# Altium schematic sheet 01 - Notes.SchDoc: 25kW WolfPACK FM3 Six-Pack Inverter
size 431 x 279 mm; Date: 09/2024; DocumentNumber: CRD25DA12N-FMC; Revision: 2.0; SheetNumber: 1; SheetTotal: 9; SheetSize: B
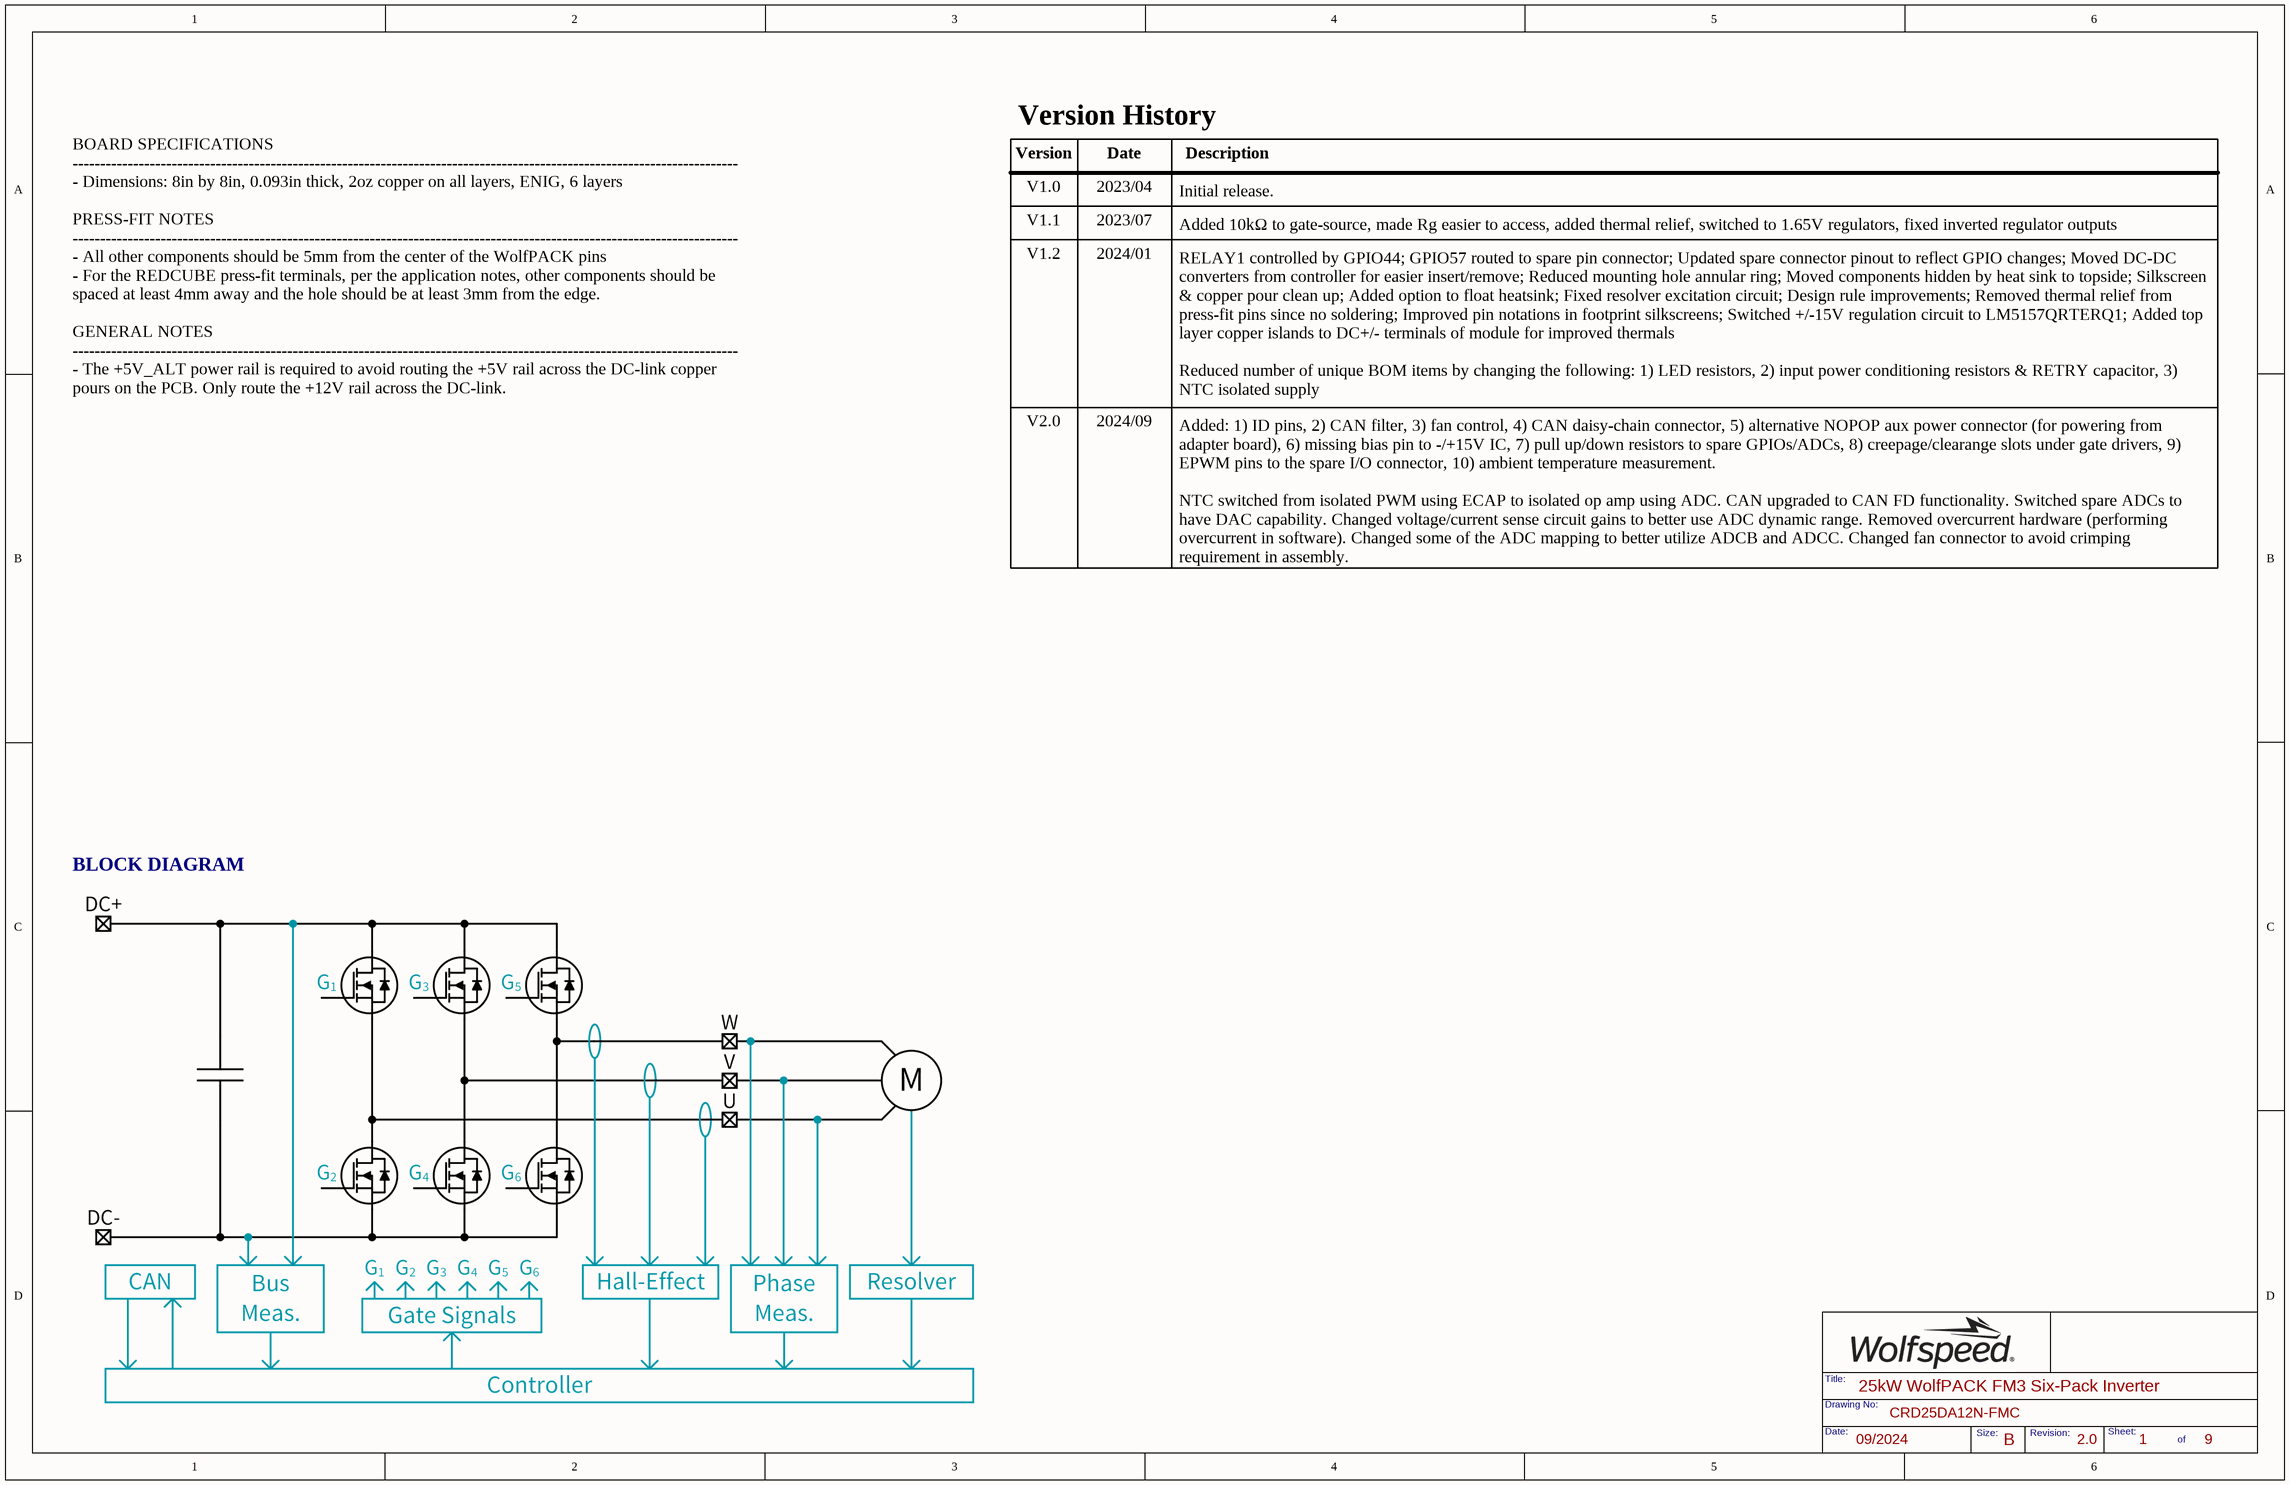
[diagram p0: 01 - Notes.SchDoc]

## Notes on the sheet
- Version History
- Version
- Date
- Description
- V1.0
- V1.1
- 2023/04
- 2023/07
- Initial release.
- Added 10kΩ to gate-source, made Rg easier to access, added thermal relief, switched to 1.65V regulators, fixed inverted regulator outputs
- V1.2
- 2024/01
- V2.0
- 2024/09
- RELAY1 controlled by GPIO44; GPIO57 routed to spare pin connector; Updated spare connector pinout to reflect GPIO changes; Moved DC-DC converters from controller for easier insert/remove; Reduced mounting hole annular ring; Moved components hidden by heat sink to topside; Silkscreen & copper pour clean up; Added option to float heatsink; Fixed resolver excitation circuit; Design rule improvements; Removed thermal relief from press-fit pins since no soldering; Improved pin notations in footprint silkscreens; Switched +/-15V regulation circuit to LM5157QRTERQ1; Added top layer copper islands to DC+/- terminals of module for improved thermals
  Reduced number of unique BOM items by changing the following: 1) LED resistors, 2) input power conditioning resistors & RETRY capacitor, 3) NTC isolated supply
- BOARD SPECIFICATIONS
  -------------------------------------------------------------------------------------------------------------------------
  - Dimensions: 8in by 8in, 0.093in thick, 2oz copper on all layers, ENIG, 6 layers
  PRESS-FIT NOTES
  -------------------------------------------------------------------------------------------------------------------------
  - All other components should be 5mm from the center of the WolfPACK pins
  - For the REDCUBE press-fit terminals, per the application notes, other components should be spaced at least 4mm away and the hole should be at least 3mm from the edge.
  GENERAL NOTES
  -------------------------------------------------------------------------------------------------------------------------
  - The +5V_ALT power rail is required to avoid routing the +5V rail across the DC-link copper pours on the PCB. Only route the +12V rail across the DC-link.
- Added: 1) ID pins, 2) CAN filter, 3) fan control, 4) CAN daisy-chain connector, 5) alternative NOPOP aux power connector (for powering from adapter board), 6) missing bias pin to -/+15V IC, 7) pull up/down resistors to spare GPIOs/ADCs, 8) creepage/clearange slots under gate drivers, 9) EPWM pins to the spare I/O connector, 10) ambient temperature measurement.
  NTC switched from isolated PWM using ECAP to isolated op amp using ADC. CAN upgraded to CAN FD functionality. Switched spare ADCs to have DAC capability. Changed voltage/current sense circuit gains to better use ADC dynamic range. Removed overcurrent hardware (performing overcurrent in software). Changed some of the ADC mapping to better utilize ADCB and ADCC. Changed fan connector to avoid crimping requirement in assembly.
- BLOCK DIAGRAM
- Title:
- Date:
- Drawing No:
- Size:
- Revision:
- Sheet:
- of